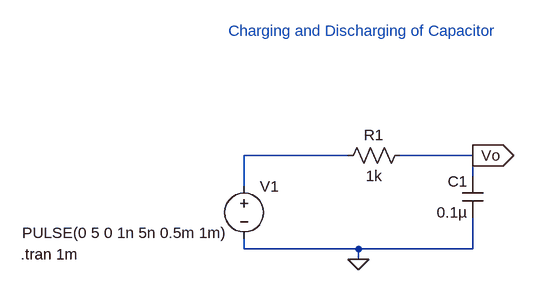
[diagram p0: schematic Capacitor.asc]
Capacitor.asc, the LTspice schematic file:
Version 4
SHEET 1 880 680
WIRE 176 112 16 112
WIRE 368 112 256 112
WIRE 368 144 368 112
WIRE 16 160 16 112
WIRE 16 256 16 240
WIRE 192 256 16 256
WIRE 368 256 368 208
WIRE 368 256 192 256
WIRE 192 272 192 256
FLAG 192 272 0
FLAG 368 112 Vo
IOPIN 368 112 Out
SYMBOL cap 384 208 R180
WINDOW 0 24 56 Left 2
WINDOW 3 24 8 Left 2
SYMATTR InstName C1
SYMATTR Value 0.1µ
SYMBOL res 272 96 R90
WINDOW 0 0 56 VBottom 2
WINDOW 3 32 56 VTop 2
SYMATTR InstName R1
SYMATTR Value 1k
SYMBOL voltage 16 144 R0
WINDOW 3 -342 87 Left 2
WINDOW 123 0 0 Left 0
WINDOW 39 0 0 Left 0
SYMATTR InstName V1
SYMATTR Value PULSE(0 5 0 1n 5n 0.5m 1m)
TEXT -328 264 Left 2 !.tran 1m
TEXT -8 -80 Left 2 ;Charging and Discharging of Capacitor

The netlist it stands for:
* Capacitor.asc
C1 0 Vo 0.1µ
R1 Vo N001 1k
V1 N001 0 PULSE(0 5 0 1n 5n 0.5m 1m)
.tran 1m
* Charging and Discharging of Capacitor
.backanno
.end

* Results of the author's LTspice run, read from the files saved beside the schematic
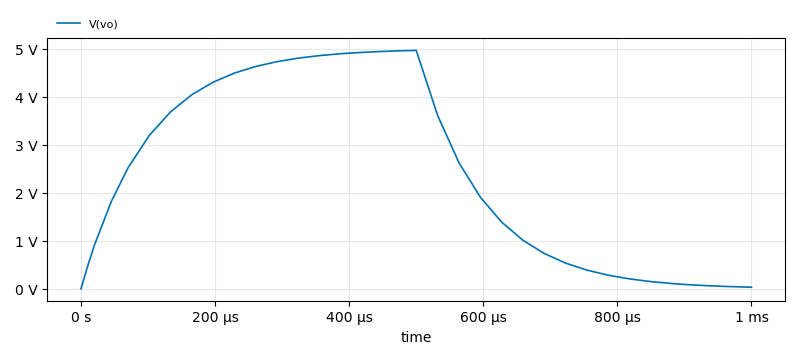
[diagram p1: Transient Analysis of Capacitor.asc, plotted from the saved traces]
* Transient Analysis, 1 run:
*   V(vo): min 0 V, max 4.966 V, average 2.498 V, rms 3.17 V, last 33.46 mV